# Altium schematic sheet Power_supply.SchDoc
size A4
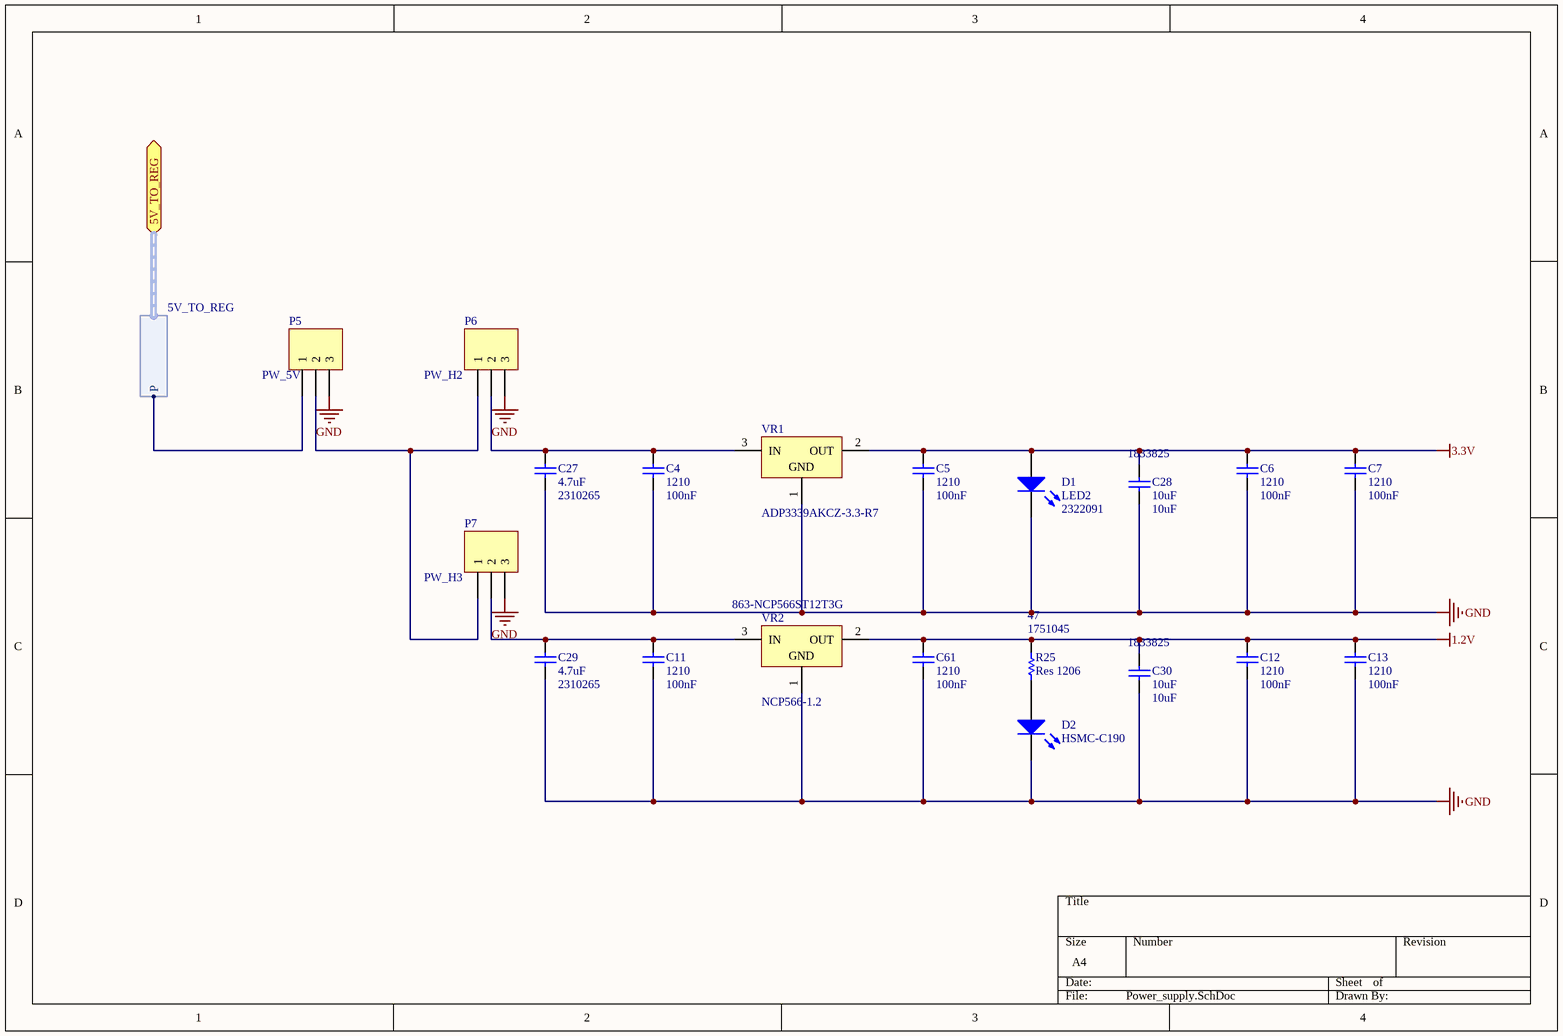
[diagram p0: Power_supply.SchDoc]

## Parts
C4  1210  value 100nF  [CAPC1210(3225)105_L]
C5  1210  value 100nF  [CAPC1210(3225)105_L]
C6  1210  value 100nF  [CAPC1210(3225)105_L]
C7  1210  value 100nF  [CAPC1210(3225)105_L]
C11  1210  value 100nF  [CAPC1210(3225)105_L]
C12  1210  value 100nF  [CAPC1210(3225)105_L]
C13  1210  value 100nF  [CAPC1210(3225)105_L]
C27  4.7uF  Supplier Part Number 1: 2310265  [C1206]
C28  10uF  Supplier Part Number 1: 1833825  [C1206]
C29  4.7uF  Supplier Part Number 1: 2310265  [C1206]
C30  10uF  Supplier Part Number 1: 1833825  [C1206]
C61  1210  value 100nF  [CAPC1210(3225)105_L]
D1  LED2  Supplier Part Number 1: 2322091  [C1206]
D2  HSMC-C190  [1.6X0.8X0.8]
P5  PW_5V  [HDR1X3]
P6  PW_H2  [HDR1X3]
P7  PW_H3  [HDR1X3]
R25  Res 1206  Supplier Part Number 1: 1751045  Resistance: 47  [RESC1206(3216)_L]
VR1  ADP3339AKCZ-3.3-R7  [ADI-KC-3_M]
VR2  NCP566-1.2  Supplier Part Number 1: 863-NCP566ST12T3G  [SOT223_N]

## Ports
5V_TO_REG (harness 5V_TO_REG)

## Harnesses
5V_TO_REG: P

## Nets
1.2V: C12.2 C13.2 C30.2 C61.2 R25.1 VR2.2(OUT)
3.3V: C5.2 C6.2 C7.2 C28.2 D1.1(A) VR1.2(OUT)
GND: C4.1 C5.1 C6.1 C7.1 C11.1 C12.1 C13.1 C27.1 C28.1 C29.1 C30.1 C61.1 D1.2(K) D2.2(K) P5.3 P6.3 P7.3 VR1.1(GND) VR2.1(GND)
NetC4_2: C4.2 C27.2 P6.2 VR1.3(IN)
NetC11_2: C11.2 C29.2 P7.2 VR2.3(IN)
NetD2_1: D2.1(A) R25.2
NetP5_1: P5.1 ; port 5V_TO_REG.P
NetP5_2: P5.2 P6.1 P7.1

## Library data of the parts
C4-C7 C11-C13 C61 = CMP-1038-01663-1: CAP 100nF 100V ±5% 1210 (3225 Metric) Thickness 1.05mm SMD; Case-Metric: 3225; Max Thickness: 1.05 mm; Rated Voltage: 100 V; Tolerance: ±5%; Case-EIA: 1210; Technology: SMT
C27 C29 = Cap Semi: Capacitor (Semiconductor SIM Model); Manufacturer: AVX; Manufacturer Part Number: 12061Z475KAT2A; Value: 100pF; Capacitance: 4.7; Capacitance Tolerance: ± 10%; Dielectric Characteristic: X7; Voltage Rating: 100; Ceramic Capacitor Case: 1206 [3216 Metric]; SVHC: No SVHC (16-Jun-2014); Capacitor Terminals: SMD<!--FANDB--><div class="features-and-benefits-container"></div>; Published: 8-Jun-2000; LatestRevisionDate: 29-May-2009; LatestRevisionNote: IPC-7351 Footprint Added.; PackageReference: C1206; Publisher: Altium Limited; PackageDescription: Chip Capacitor; Supplier 1: Farnell; RoHS: YES; Stock 1: 213; Pricing 1: 1=6,85, 50=6,2, 100=4,8, 1000=3,85, 2000=2,45 (EUR); Product Range: -; Operating Temperature Min: -55; Operating Temperature Max: 125; Packaging: Cut Tape; MSL: MSL 1 - Unlimited; Capacitance Tolerance ±: ± 10%; Capacitor Case Style: 1206 [3216 Metric]; ComponentLink1URL: http://www.farnell.com/datasheets/1789384.pdf; ComponentLink1Description: http://www.farnell.com/datasheets/1789384.pdf
C28 C30 = Cap Semi: Capacitor (Semiconductor SIM Model); Manufacturer: AVX; Manufacturer Part Number: 12063D106KAT2A; Capacitance: 10; Capacitance Tolerance: ± 10%; Dielectric Characteristic: X5; Voltage Rating: 25; Ceramic Capacitor Case: 1206 [3216 Metric]; SVHC: No SVHC (16-Dec-2013); Capacitor Terminals: SMD; Published: 8-Jun-2000; LatestRevisionDate: 29-May-2009; LatestRevisionNote: IPC-7351 Footprint Added.; PackageReference: C1206; Publisher: Altium Limited; PackageDescription: Chip Capacitor; Value: 10uF; Supplier 1: Farnell; RoHS: YES; Stock 1: 16889; Pricing 1: 10=3.58, 100=2.42, 500=1.21, 1000=1, 2000=0.8 (EUR); Product Range: -; Operating Temperature Min: -55; Operating Temperature Max: 85; Packaging: Cut Tape; MSL: MSL 1 - Unlimited; Capacitance Tolerance ±: ± 10%; Capacitor Case Style: 1206 [3216 Metric]; Operating Temperature Range: -55°C to +85; Series: Hi-Cap MLCC<!--FANDB--><div class="features-and-benefits-container"></div>; ComponentLink1URL: http://www.farnell.com/datasheets/1796776.pdf; ComponentLink1Description: http://www.farnell.com/datasheets/1796776.pdf
D1 = LED2: Typical RED, GREEN, YELLOW, AMBER GaAs LED; Manufacturer: WURTH ELEKTRONIK; Manufacturer Part Number: 156120GS75300; Published: 8-Jun-2000; LatestRevisionDate: 17-Jul-2002; LatestRevisionNote: Re-released for DXP Platform.; PackageVersion: Feb-2002; PackageReference: 3.2X1.6X1.1; Publisher: Altium Limited; PackageDescription: SM LED; 2 Flat Leads; Supplier 1: Farnell; RoHS: YES; Stock 1: 15358; Pricing 1: 1=5,3, 50=4,9, 100=4,6, 500=3,65, 2000=3,3, 5000=2,95, 5000=2,65, 30000=2,4 (EUR); ComponentLink1URL: http://katalog.we-online.de/led/datasheet/156120GS75300.pdf; ComponentLink1Description: http://katalog.we-online.de/led/datasheet/156120GS75300.pdf
D2 = HSMC-C190: High Performance Chip LED, Red; LuminousIntensity: 25mcd (Minimum).; PCB_Layout: Complies with manufacturer's recommendation.; Published: 11-Dec-2002; DatasheetVersion: 11-Mar-2002; PackageVersion: Mar-2002; PackageReference: 1.6X0.8X0.8; Publisher: Altium Limited; PackageDescription: SM LED; 2 Flat Leads; LED_Colour: Red; ComponentLink1Description: Manufacturer Link; ComponentLink1URL: http://www.avagotech.com/; ComponentLink2Description: Datasheet; ComponentLink2URL: http://cp.literature.agilent.com/litweb/pdf/5988-5891EN.pdf
P5-P7 = Header 3: Header, 3-Pin; LatestRevisionDate: 17-Jul-2002; LatestRevisionNote: Re-released for DXP Platform.; Publisher: Altium Limited
R25 = CMP-1014-00056-1: 105R 0.25W 5% 1206 (3216 Metric)  SMD; Manufacturer: PANASONIC; Manufacturer Part Number: ERJB2AF470V; Case-Metric: 3216; Case-EIA: 1206; Product Range: PANASONIC - ERJ Wide Terminal Series; Power Rating: 0.5; Resistance Tolerance: ± 1%; Resistor Case Style: 1206 Wide; Resistor Element Material: Thick Film; Temperature Coefficient: ± 100; Voltage Rating: 200; SVHC: No SVHC (16-Dec-2013); External Depth: 1.6; External Length / Height: 0.65; External Width: 3.2; No. of Pins: 2; Overload Voltage: 400; Reel Quantity: 5000; Technology: SMT; Tolerance: 5 %; Value: 105R; Power: 0.25 W; Supplier 1: Farnell; RoHS: YES; Stock 1: 185; Pricing 1: 5=1,83, 50=1,71, 100=1,61, 500=1,52, 5000=1,44 (EUR); Packaging: Cut Tape; MSL: -; Operating Temperature Max: 155; Operating Temperature Min: -55; Operating Temperature Range: -55°C to +155; Resistor Mounting: SMD; Series: ERJ<!--FANDB--><div class="features-and-benefits-container"></div>; ComponentLink1URL: http://www.farnell.com/datasheets/436795.pdf; ComponentLink1Description: http://www.farnell.com/datasheets/436795.pdf; ComponentLink2URL: http://www.farnell.com/datasheets/1718548.pdf; ComponentLink2Description: http://www.farnell.com/datasheets/1718548.pdf; ComponentLink3URL: http://www.farnell.com/cad/1697905.zip; ComponentLink3Description: http://www.farnell.com/cad/1697905.zip
VR1 = CMP-0786-00156-1: High Accuracy, Ultralow IQ, 1.5 A, anyCAP Low Dropout Regulator, 2.8 to 6 V Vin, 3.3 V Vout, Industrial, 3-pin SOT223 (KC-3), Reel; Manufacturer: Analog Devices; Vin (max) (V): 6; Supply Current IGND @ Small Load: 130uA; Iout max: 1.5A; Preset Vout Values (V): 3.3; Vin (min) (V): 2.8; Code_JEDEC: TO-261-AA; ComponentLink3URL: http:/www.analog.com/static/imported-files/packages/PKG_PDF/SOT_223(KC)/KC_3.pdf; ComponentLink4URL: Product URL:http://www.analog.com/en/ADP3339/productSearch.html; Mounting Technology: Surface Mount; ComponentLink2URL: http://www.analog.com/static/imported-files/data_sheets/ADP3339.pdf; DatasheetVersion: Rev. C; ComponentLink1URL: http://www.analog.com/en/index.html; PackageDescription: 3-Pin Small Outline Transistor Package, Body 3.5 x 6.5 mm, Pitch 2.3 mm; Packing: Reel; PartNumber: ADP3339AKCZ-3.3-R7; ComponentLink3Description: Package Specification; PackageReference: KC-3; ComponentLink1Description: Manufacturer URL; ComponentLink2Description: Datasheet; PackageVersion: 11-20-2012-B, 11/2012; ComponentLink4Description: URL Link1
VR2 = LM1084IT-3.3: 5A Low Dropout Positive Regulators, 3-pin TO-220; Manufacturer: ON Semiconductor; Manufacturer Part Number: NCP566ST12T3G; Input Voltage MAX: 9 V; Number of Outputs: 1 Output; Output Current: 1.5 A; Output Type: Fixed; Output Voltage: 1.2 V; Dropout Voltage - Max: 1.3 V at 1.5 mA; Voltage Regulation Accuracy: 3 %; Line Regulation: 0.02 %; Load Regulation: 0.04 %; Reference Voltage: 0.9 V; Supplier 1: Mouser; RoHS: RoHS Compliant; Category: LDO Voltage Regulators; Stock 1: 3461; Pricing 1: 1=1.42, 10=1.13, 100=0.871, 500=0.770, 1000=0.608, 4000=0.539, 8000=0.518, 24000=0.502 (AUD); Package / Case: SOT-223; Packaging: Reel; Series: NCP566; Brand: ON Semiconductor; Mounting Style: SMD/SMT; Maximum Operating Temperature: + 125 C; Minimum Operating Temperature: - 40 C; Product Category: Amplifiers- Audio; Standard Pack Qty: 4000; RoHS - Mouser: Y; Minimum Order Quantity: 1; Reeling: True; ComponentLink1URL: http://www.farnell.com/datasheets/115299.pdf; ComponentLink1Description: http://www.farnell.com/datasheets/115299.pdf